# Altium schematic sheet NOR.SchDoc
size A4
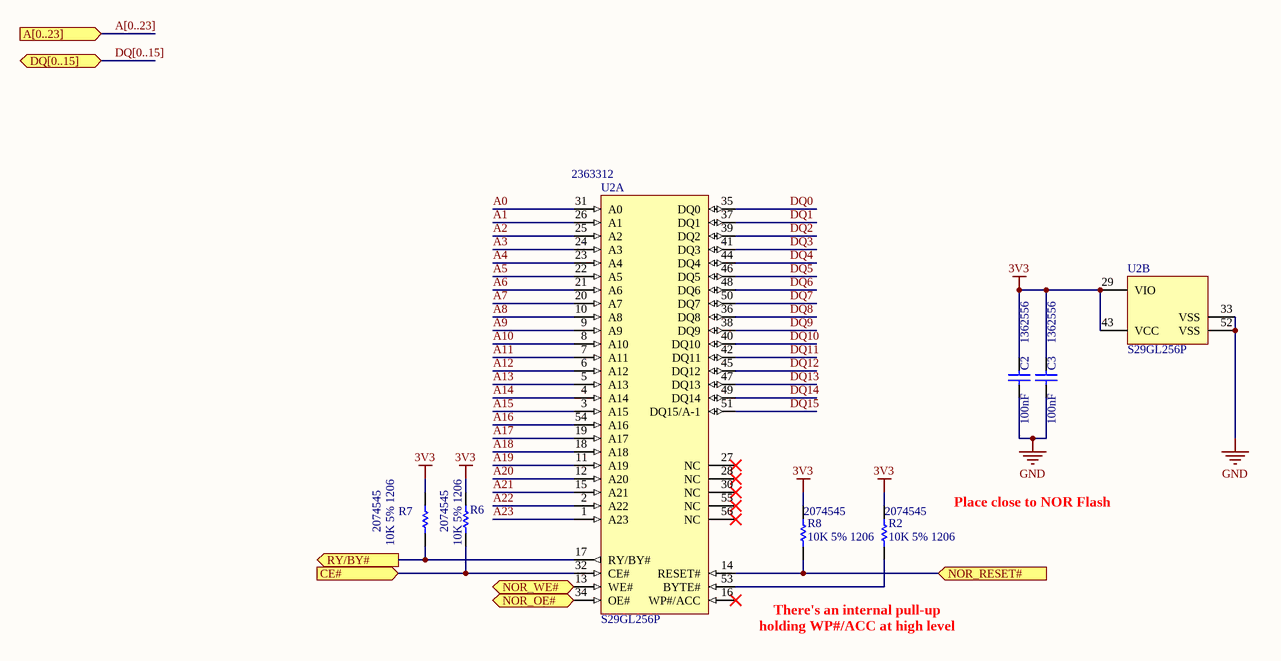
[diagram p0: NOR.SchDoc]

## Parts
C2  100nF  Supplier Part Number 1: 1362556  [CAPC0603(1608)100_N]
C3  100nF  Supplier Part Number 1: 1362556  [CAPC0603(1608)100_N]
R2  10K 5% 1206  Supplier Part Number 1: 2074545  [RESC1206(3216)_M]
R6  10K 5% 1206  Supplier Part Number 1: 2074545  [RESC1206(3216)_M]
R7  10K 5% 1206  Supplier Part Number 1: 2074545  [RESC1206(3216)_M]
R8  10K 5% 1206  Supplier Part Number 1: 2074545  [RESC1206(3216)_M]
U2  S29GL256P  Supplier Part Number 1: 2363312  [56-Pin_Standard_TSOP]  (parts A,B of 2)

## Ports
A[0..23] (in), CE# (in), DQ[0..15] (bidir), NOR_OE# (in), NOR_RESET# (in), NOR_WE# (in), RY/BY# (out)

## Nets
3V3: C2.2 C3.2 R2.2 R6.2 R7.2 R8.2 U2.29(VIO) U2.43(VCC)
GND: C2.1 C3.1 U2.33(VSS) U2.52(VSS)
A0: U2.31(A0)
A1: U2.26(A1)
A2: U2.25(A2)
A3: U2.24(A3)
A4: U2.23(A4)
A5: U2.22(A5)
A6: U2.21(A6)
A7: U2.20(A7)
A8: U2.10(A8)
A9: U2.9(A9)
A10: U2.8(A10)
A11: U2.7(A11)
A12: U2.6(A12)
A13: U2.5(A13)
A14: U2.4(A14)
A15: U2.3(A15)
A16: U2.54(A16)
A17: U2.19(A17)
A18: U2.18(A18)
A19: U2.11(A19)
A20: U2.12(A20)
A21: U2.15(A21)
A22: U2.2(A22)
A23: U2.1(A23)
CE#: R6.1 U2.32(CE#) ; port CE#
DQ0: U2.35(DQ0)
DQ1: U2.37(DQ1)
DQ2: U2.39(DQ2)
DQ3: U2.41(DQ3)
DQ4: U2.44(DQ4)
DQ5: U2.46(DQ5)
DQ6: U2.48(DQ6)
DQ7: U2.50(DQ7)
DQ8: U2.36(DQ8)
DQ9: U2.38(DQ9)
DQ10: U2.40(DQ10)
DQ11: U2.42(DQ11)
DQ12: U2.45(DQ12)
DQ13: U2.47(DQ13)
DQ14: U2.49(DQ14)
DQ15: U2.51(DQ15/A-1)
NOR_OE#: U2.34(OE#) ; port NOR_OE#
NOR_RESET#: R8.1 U2.14(RESET#) ; port NOR_RESET#
NOR_WE#: U2.13(WE#) ; port NOR_WE#
RY/BY#: R7.1 U2.17(RY/BY#) ; port RY/BY#
NetR2_1: R2.1 U2.53(BYTE#)

Not connected (* = marked no-connect by the designer): U2 16(WP#/ACC)* 27(NC)* 28(NC)* 30(NC)* 55(NC)* 56(NC)*

## Buses and harness runs
bus A[0..23] = port A[0..23]
bus DQ[0..15] = port DQ[0..15]

## Notes on the sheet
- (near R2) Place close to NOR Flash
- There's an internal pull-up holding WP#/ACC at high level

## Library data of the parts
C2 C3 = CMP-1035-02592-1: CAP 100nF 50V ±10% 0603 (1608 Metric) Thickness 1mm SMD; Case-EIA: 0603; Case-Metric: 1608; Technology: SMT; Rated Voltage: 50 V; Max Thickness: 1 mm; Tolerance: ±10%; Value: 100nF; Supplier 1: Farnell
R2 R6-R8 = CMP-1014-00098-1: 10K 0.25W 5% 1206 (3216 Metric)  SMD; Manufacturer: YAGEO (PHYCOMP); Manufacturer Part Number: RC1206JR-0710KL; Value: 10000.00 Ohm; Case-Metric: 3216; Case-EIA: 1206; Power: 0.25 W; Tolerance: 5 %; Technology: SMT; RoHS: YES; ComponentLink1URL: http://www.farnell.com/datasheets/444357.pdf; ComponentLink1Description: http://www.farnell.com/datasheets/444357.pdf; ComponentLink2URL: http://www.farnell.com/cad/1539272.zip; ComponentLink2Description: http://www.farnell.com/cad/1539272.zip; Supplier 1: Farnell
U2 = S29GL256P: Supplier 1: Farnell